# Altium schematic sheet PART-03-各种警告音电路R150-199.SchDoc
size A4
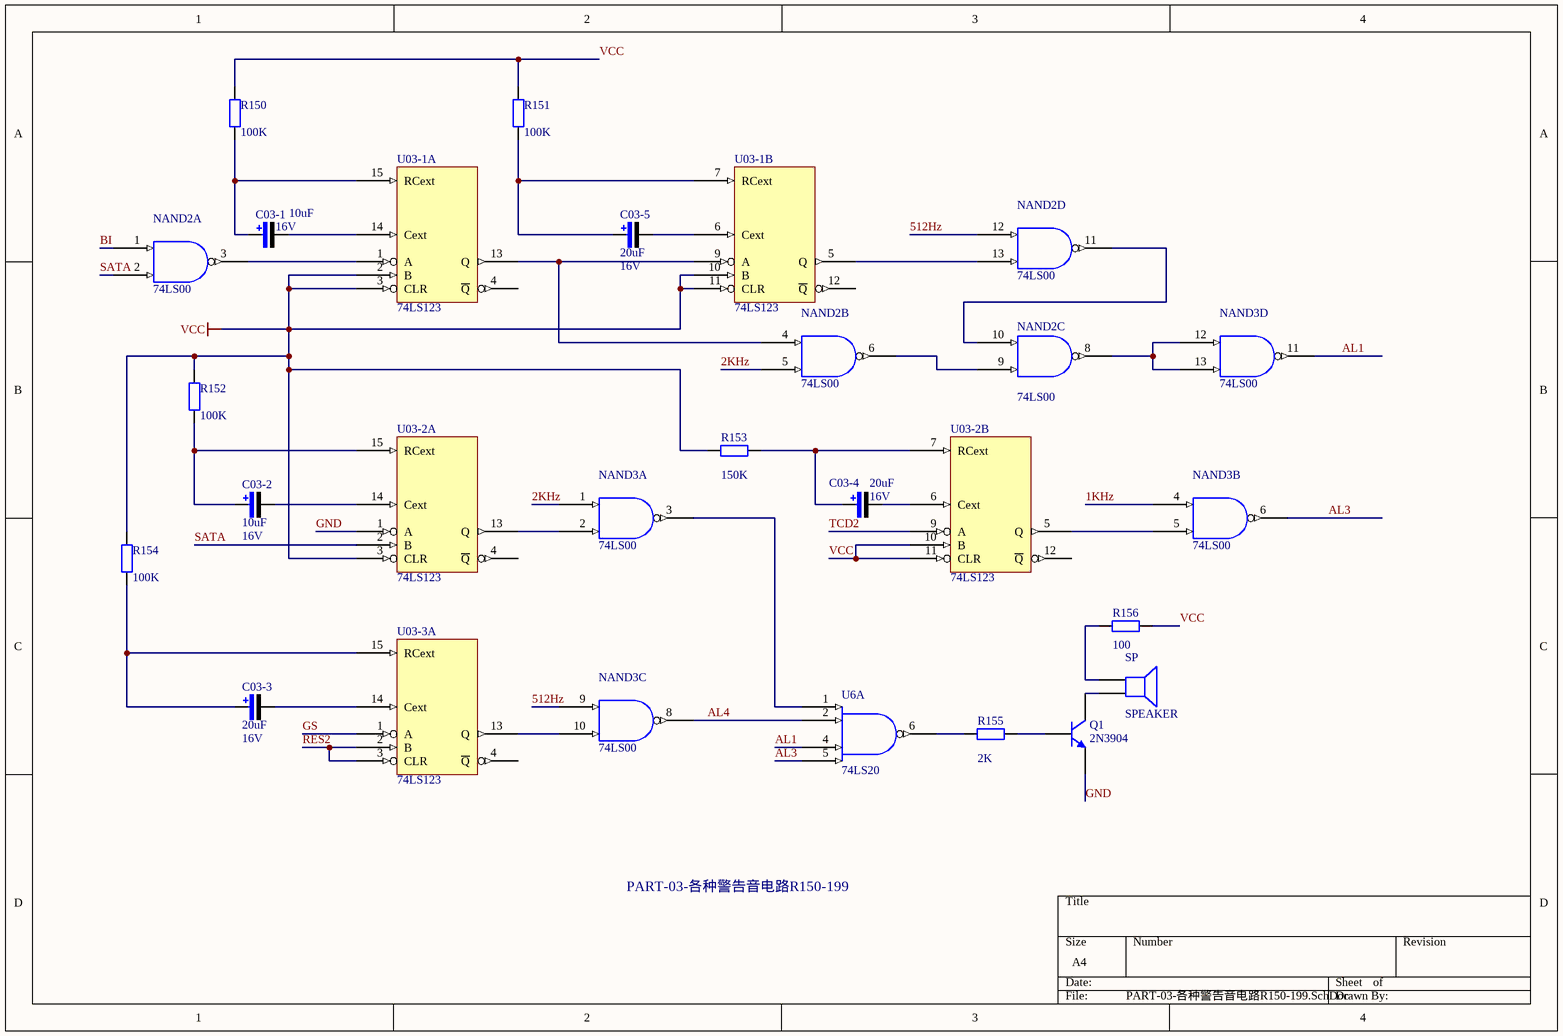
[diagram p0: PART-03-各种警告音电路R150-199.SchDoc]

## Parts
C03-1  value 10uF  Vol: 16V  [C-RB-18]  (hidden comment: Cap Pol)
C03-2  value 10uF  Vol: 16V  [C-RB-18]  (hidden comment: Cap Pol)
C03-3  value 20uF  Vol: 16V  [C-RB-18]  (hidden comment: Cap Pol)
C03-4  value 20uF  Vol: 16V  [C-RB-18]  (hidden comment: Cap Pol)
C03-5  value 20uF  Vol: 16V  [C-RB-18]  (hidden comment: Cap Pol)
NAND2  74LS00  [DIP-14]  (parts A,B,C,D of 4)
NAND3  74LS00  [DIP-14]  (parts A,B,C,D of 4)
Q1  2N3904  [TO-92A]
R150  value 100K  [AXIAL-0.4]  (hidden comment: Res2)
R151  value 100K  [AXIAL-0.4]  (hidden comment: Res2)
R152  value 100K  [AXIAL-0.4]  (hidden comment: Res2)
R153  value 150K  [AXIAL-0.4]  (hidden comment: Res2)
R154  value 100K  [AXIAL-0.4]  (hidden comment: Res2)
R155  value 2K  [AXIAL-0.4]  (hidden comment: Res2)
R156  value 100  [AXIAL-0.4]  (hidden comment: Res2)
SP  SPEAKER
U03-1  74LS123  [DIP-16]  (parts A,B of 2)
U03-2  74LS123  [DIP-16]  (parts A,B of 2)
U03-3  74LS123  [DIP-16]  (part A of 2)
U6  74LS20  [DIP-14]  (part A of 2)

## Nets
GND: NAND2.7(GND) NAND3.7(GND) Q1.1(E) U03-1.8(GND) U03-2.1(A) U03-2.8(GND) U03-3.8(GND) U6.7(GND)
VCC: NAND2.14(VCC) NAND3.14(VCC) R150.2 R151.2 R152.2 R153.1 R154.2 R156.2 U03-1.2(B) U03-1.3(CLR) U03-1.10(B) U03-1.11(CLR) U03-1.16(VCC) U03-2.3(CLR) U03-2.10(B) U03-2.11(CLR) U03-2.16(VCC) U03-3.16(VCC) U6.14(VCC)
1KHz: NAND3.4
2KHz: NAND2.5 NAND3.1
512Hz: NAND2.12 NAND3.9
AL1: NAND3.11 U6.4
AL3: NAND3.6 U6.5
AL4: NAND3.8 U6.2
BI: NAND2.1
GS: U03-3.1(A)
RES2: U03-3.2(B) U03-3.3(CLR)
SATA: NAND2.2 U03-2.2(B)
TCD2: U03-2.9(A)
NetC03-1_1: C03-1.1 R150.1 U03-1.15(RCext)
NetC03-1_2: C03-1.2 U03-1.14(Cext)
NetC03-2_1: C03-2.1 R152.1 U03-2.15(RCext)
NetC03-2_2: C03-2.2 U03-2.14(Cext)
NetC03-3_1: C03-3.1 R154.1 U03-3.15(RCext)
NetC03-3_2: C03-3.2 U03-3.14(Cext)
NetC03-4_1: C03-4.1 R153.2 U03-2.7(RCext)
NetC03-4_2: C03-4.2 U03-2.6(Cext)
NetC03-5_1: C03-5.1 R151.1 U03-1.7(RCext)
NetC03-5_2: C03-5.2 U03-1.6(Cext)
NetNAND2_3: NAND2.3 U03-1.1(A)
NetNAND2_4: NAND2.4 U03-1.9(A) U03-1.13(Q)
NetNAND2_6: NAND2.6 NAND2.9
NetNAND2_8: NAND2.8 NAND3.12 NAND3.13
NetNAND2_10: NAND2.10 NAND2.11
NetNAND2_13: NAND2.13 U03-1.5(Q)
NetNAND3_2: NAND3.2 U03-2.13(Q)
NetNAND3_3: NAND3.3 U6.1
NetNAND3_5: NAND3.5 U03-2.5(Q)
NetNAND3_10: NAND3.10 U03-3.13(Q)
NetQ1_2: Q1.2(B) R155.2
NetQ1_3: Q1.3(C) SP.2
NetR155_1: R155.1 U6.6
NetR156_1: R156.1 SP.1

Not connected (* = marked no-connect by the designer): U03-1 4(~{Q}) 12(~{Q}); U03-2 4(~{Q}) 12(~{Q}); U03-3 4(~{Q})

## Notes on the sheet
- PART-03-各种警告音电路R150-199

## Library data of the parts
C03-1-C03-5 = Cap Pol: 极性电解电容; Published: 8-Jun-2000; LatestRevisionDate: 17-Jul-2002; LatestRevisionNote: Re-released for DXP Platform.; PackageReference: RB7.6-15; Publisher: Altium Limited
Q1 = 2N3904: NPN General Purpose Amplifier; Published: 8-Jun-2000; LatestRevisionDate: 15-Jan-2003; LatestRevisionNote: PCB Footprint 'BCY-W3/D4.7' replaced; DatasheetDocument: 1997; PackageDocument: Sep-1998; PackageReference: TO-92A; Publisher: Altium Limited; Code_JEDEC: TO-92A; ComponentLink1Description: Manufacturer Link; ComponentLink1URL: http://www.fairchildsemi.com/; ComponentLink2Description: Datasheet; ComponentLink2URL: http://www.fairchildsemi.com/ds/2N%2F2N3904.pdf
R150-R156 = Res2: Resistor; Published: 8-Jun-2000; LatestRevisionDate: 17-Jul-2002; LatestRevisionNote: Re-released for DXP Platform.; PackageReference: AXIAL-0.4; Publisher: Altium Limited